# EAGLE design HoneyPI_Platine TimerBoard 2.00a (EAGLE 9.6.2)
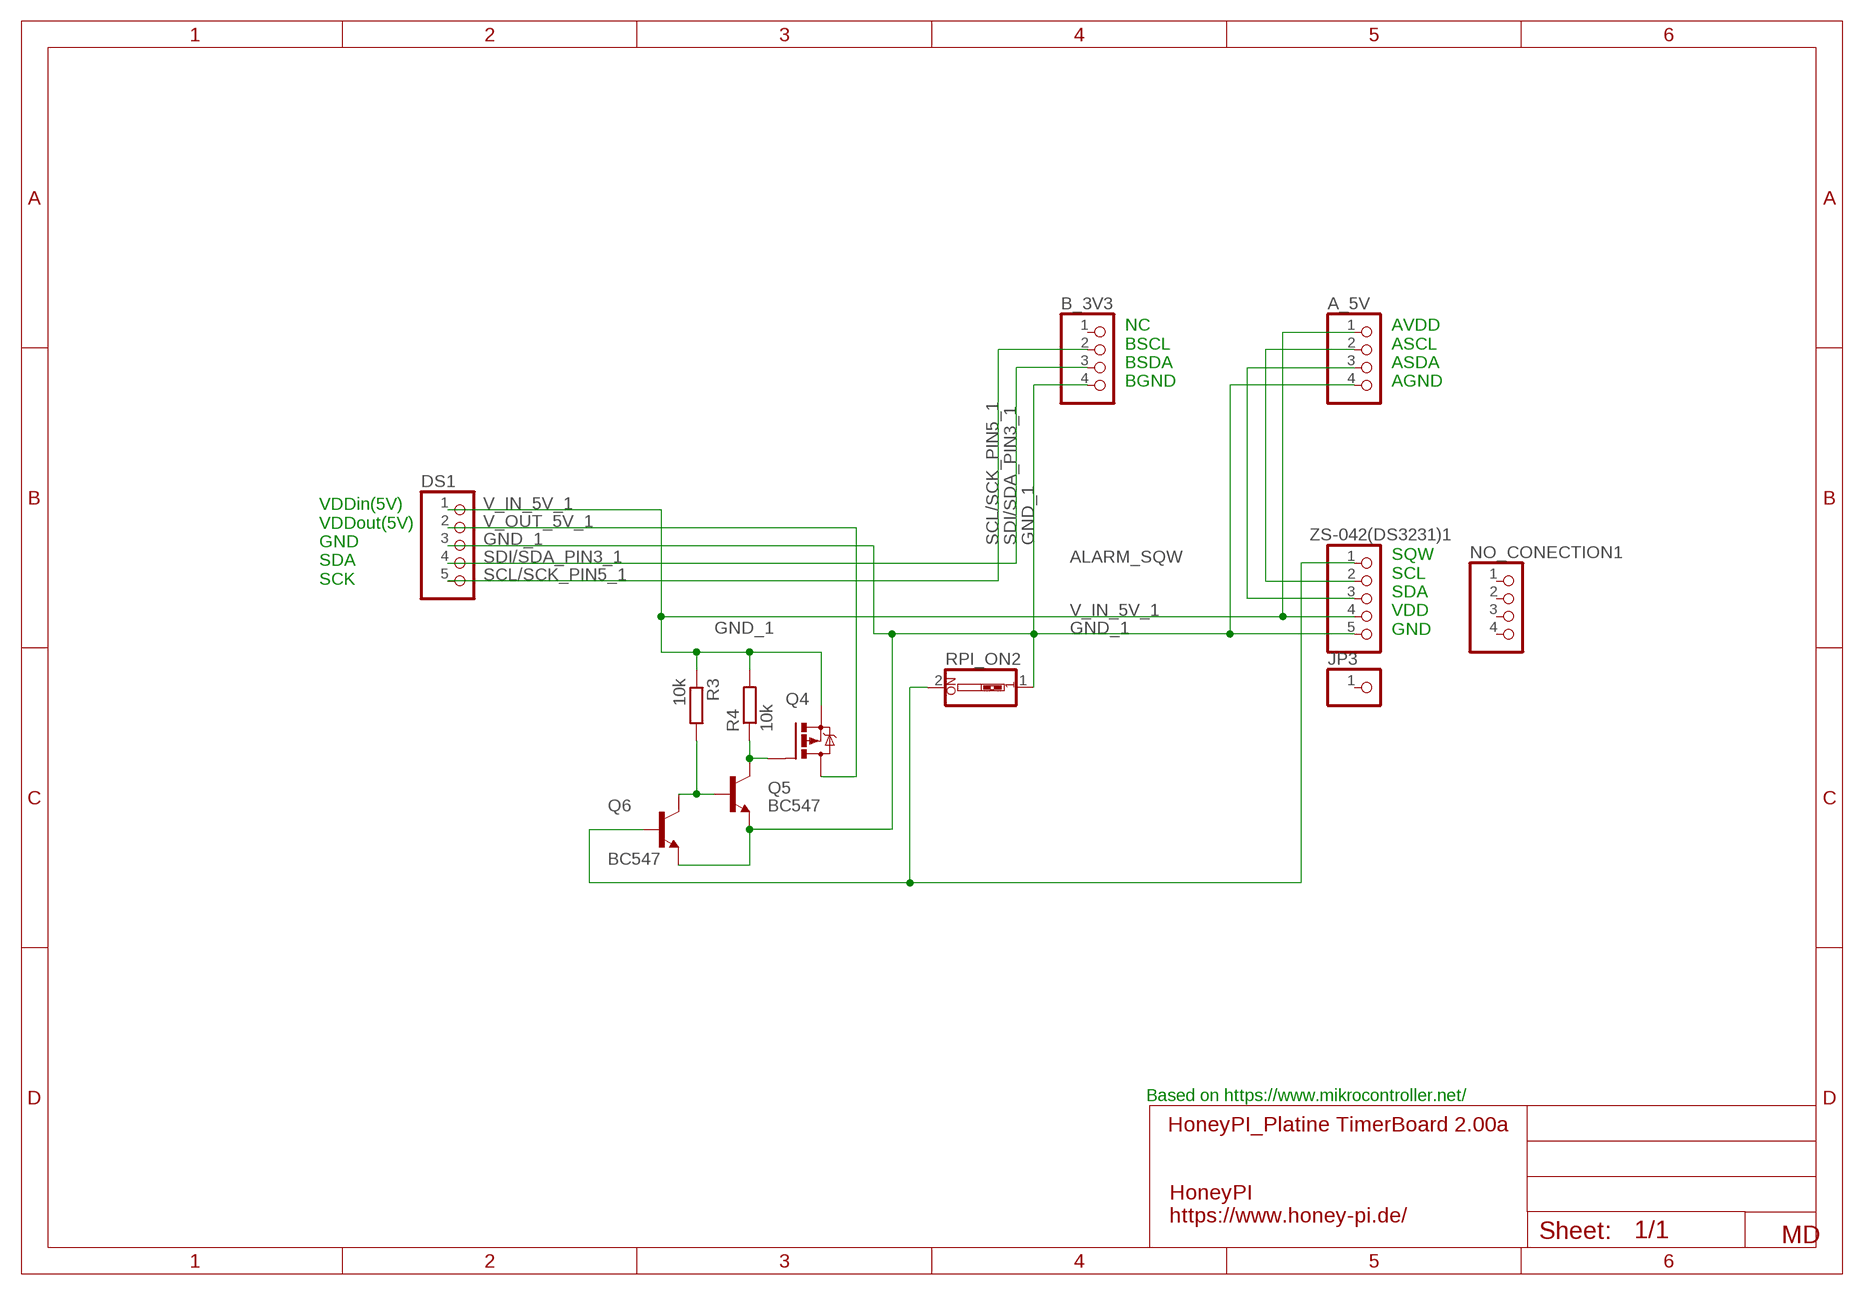
[diagram p0: schematic, sheet 1]

## Parts
A_5V  PINHD-1X4  [1X04]
B_3V3  PINHD-1X4  [1X04]
DS1  PINHD-1X5  [1X05]
JP3  PINHD-1X1  [1X01]
NO_CONECTION1  PINHD-1X4  [1X04]
Q4  NDP6020P  IRF9530  [TO220BV]
Q5  BC547  BC338  [TO92-EBC]
Q6  BC547  BC338  [TO92-EBC]
R3  10k  R-EU_0204/7  [0204/7]
R4  10k  R-EU_0204/7  [0204/7]
RPI_ON2  SW_DIP-1  [EDG-01]
ZS-042(DS3231)1  PINHD-1X5  [1X05]

## Nets
ALARM_SQW: Q6.B RPI_ON2.2 ZS-042(DS3231)1.1
GND_1 [Supply5v]: A_5V.4 B_3V3.4 DS1.3 Q5.E Q6.E RPI_ON2.1 ZS-042(DS3231)1.5
N$1: Q4.G Q5.C R4.1
N$3: Q5.B Q6.C R3.2
N$7: A_5V.3 ZS-042(DS3231)1.3
N$8: A_5V.2 ZS-042(DS3231)1.2
SCL/SCK_PIN5_1: B_3V3.2 DS1.5
SDI/SDA_PIN3_1: B_3V3.3 DS1.4
V_IN_5V_1 [Supply5v]: A_5V.1 DS1.1 Q4.S R3.1 R4.2 ZS-042(DS3231)1.4
V_OUT_5V_1 [Supply5v]: DS1.2 Q4.D
Unconnected: B_3V3.1 JP3.1 NO_CONECTION1.1 NO_CONECTION1.2 NO_CONECTION1.3 NO_CONECTION1.4

## Notes on the sheet
- NC
  BSCL
  BSDA
  BGND
- AVDD
  ASCL
  ASDA
  AGND
- VDDin(5V)
  VDDout(5V)
  GND
  SDA
  SCK
- SQW
  SCL
  SDA
  VDD
  GND
- Based on https://www.mikrocontroller.net/
- HoneyPI
  https://www.honey-pi.de/
- MD

## Library data of the parts
A_5V B_3V3 NO_CONECTION1 = pinhead:PINHD-1X4: PIN HEADER
DS1 ZS-042(DS3231)1 = pinhead:PINHD-1X5: PIN HEADER
JP3 = pinhead:PINHD-1X1: PIN HEADER
Q4 = transistor-power:IRF9530: P-CHANNEL HEXFET POWER-MOS-FET Source: http://www.irf.com/product-info/datasheets/data/irf9530.pdf
Q5 Q6 = transistor-npn:BC338*: NPN Transistor
R3 R4 = rcl:R-EU_: RESISTOR, European symbol; SPICEPREFIX: R
RPI_ON2 = special:SW_DIP-1: DIP SWITCH

## Net classes
0 Signal: width 0.152 mm, clearance 0.305 mm
1 Supply3v3: width 0.203 mm, clearance 0.305 mm
2 Supply5v: width 0.5 mm, clearance 0.305 mm

## Board
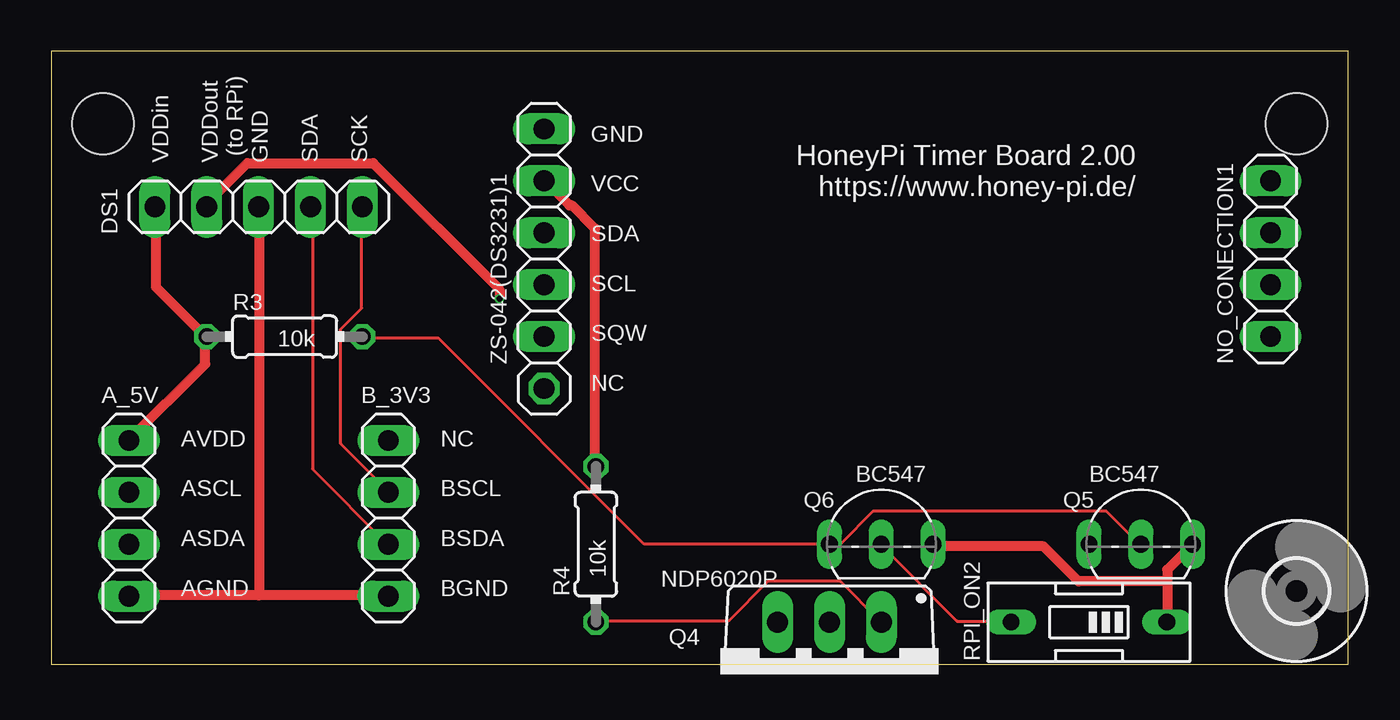
[diagram p1: board, top side]
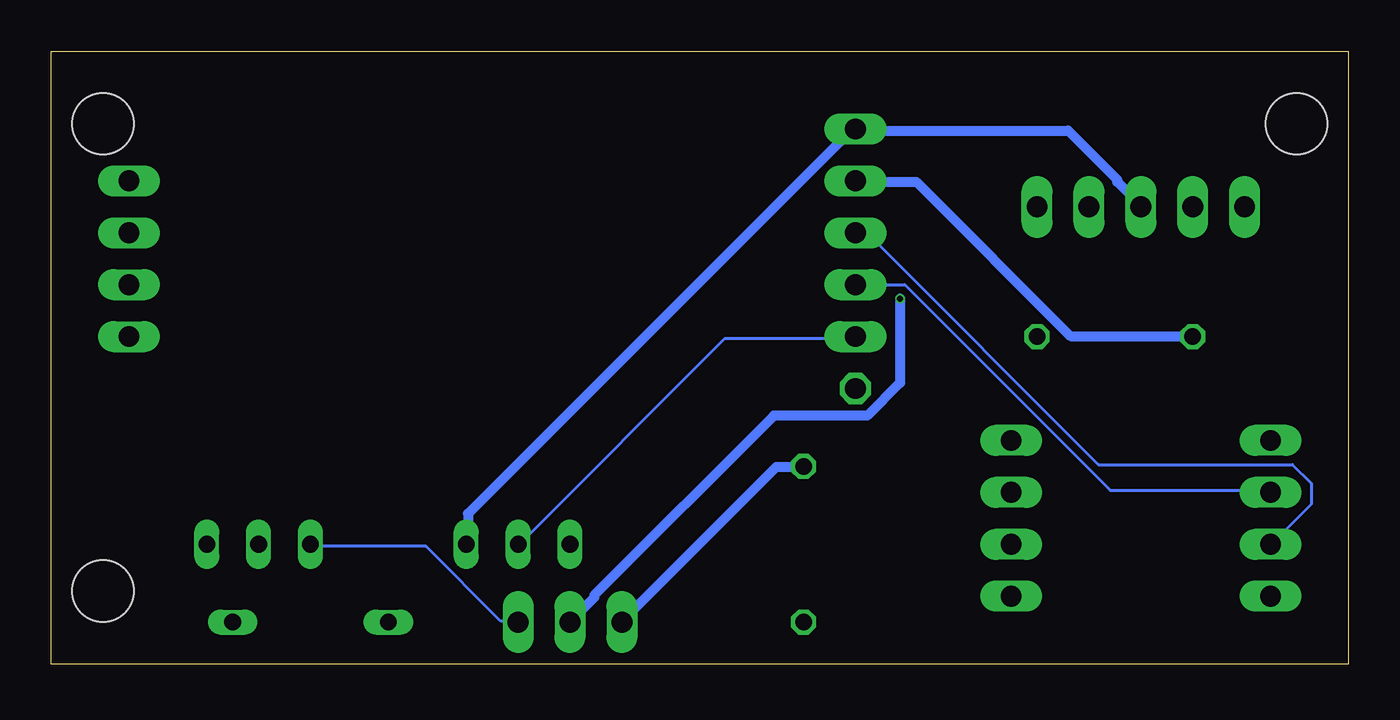
[diagram p2: board, bottom side, seen from below]

Size 63.5 x 30 mm. Coordinates in mm from the lower left corner, seen from the top.
Outline: 0,0 63.5,0 63.5,30 0,30 0,0
Copper layers (1*16): Top 0.035559375mm / dielectric 1.6mm / Bottom 0.035559375mm
Design rules "jlcpcb2layer": minimum track width 5mil, minimum drill 12mil, track to track 5mil, track to pad 5mil, pad to pad 5mil, via to via 5mil, smd to smd 5mil, copper to edge 8mil, drill to drill 6mil, minimum pad ring 5mil, minimum via ring 3mil, stop-mask expansion 2.5mil, vias tented up to drill 0mil, thermal gap 10mil
Holes 3 mm at 2.54,26.44 60.96,26.44

### Footprints (pad centres in the part's own frame; a part is rotated, then mirrored left to right if it is on the bottom)
1X04 = drill 1.016 long: 1 -3.81,0; 2 -1.27,0; 3 1.27,0; 4 3.81,0
1X05 = drill 1.016 long: 1 -5.08,0; 2 -2.54,0; 3 0,0; 4 2.54,0; 5 5.08,0
1X01 = drill 1.016 octagon: 1 0,0
TO220BV = drill 1.016 long: D 0,-2.54; G -2.54,-2.54; S 2.54,-2.54
TO92-EBC = drill 0.813 long: B 0,-1.27; C -2.54,-1.27; E 2.54,-1.27
0204/7 = drill 0.813 octagon: 1 -3.81,0; 2 3.81,0
EDG-01 = drill 0.813 long: 1 0,-3.81; 2 0,3.81
3,0 = hole 3: 0,0

### Placement (x,y rotation side)
A_5V  3.81,7.14 270 top
B_3V3  16.51,7.14 270 top
DS1  10.16,22.38 0 top
JP3  24.13,13.49 0 top
NO_CONECTION1  59.69,19.84 90 top
Q4  38.1,-0.48 180 top
Q5  53.34,7.14 0 top
Q6  40.64,7.14 0 top
R3  11.43,16.03 0 top
R4  26.67,5.87 90 top
RPI_ON2  50.8,2.06 90 top
U$1  [3,0]  60.96,3.58 0 top
ZS-042(DS3231)1  24.13,21.11 90 top

### Tracks (layer width: path | path; a pad name or v marks a point on that pad's centre or on a via)
ALARM_SQW
  Top 0.152: RPI_ON2.2 46.98,2.11 44.35,2.11 40.69,5.77 Q6.B
  Bottom 0.152: ZS-042(DS3231)1.1 24.23,15.94 30.52,15.94 40.58,5.88 Q6.B
GND_1
  Top 0.5: 54.63,4.05 54.63,4.62 Q5.E | 54.63,4.05 54.63,2.11 RPI_ON2.1 | 54.63,4.05 50.29,4.05 48.58,5.77 43.2,5.77 Q6.E | 10.17,3.37 16.46,3.37 B_3V3.4 | 10.17,3.37 3.89,3.37 A_5V.4 | 10.17,3.37 10.17,22.34 DS1.3
  Bottom 0.5: DS1.3 10.17,22.46 11.32,23.6 11.32,23.71 13.72,26.11 24.12,26.11 ZS-042(DS3231)1.5 24.35,26.11 43.09,7.37 43.09,5.88 Q6.E
N$1
  Top 0.152: R4.1 26.75,2.11 33.15,2.11 35.09,4.05 38.63,4.05 40.58,2.11 Q4.G
  Bottom 0.152: Q5.C 50.75,5.77 45.15,5.77 41.49,2.11 40.69,2.11 Q4.G
N$3
  Top 0.152: Q5.B 53.26,5.88 51.66,7.48 40.23,7.48 38.63,5.88 38.18,5.88 Q6.C 38.06,5.88 29.03,5.88 18.97,15.94 15.32,15.94 R3.2
N$7
  Bottom 0.152: A_5V.3 3.77,5.88 1.83,7.83 1.83,8.86 2.74,9.77 12.23,9.77 23.55,21.09 24.12,21.09 ZS-042(DS3231)1.3
N$8
  Bottom 0.152: ZS-042(DS3231)1.2 21.72,18.57 11.66,8.51 3.89,8.51 A_5V.2
SCL/SCK_PIN5_1
  Top 0.152: DS1.5 15.2,22.34 15.2,17.43 14.17,16.4 14.17,10.8 16.46,8.51 B_3V3.2
SDI/SDA_PIN3_1
  Top 0.152: B_3V3.3 16.46,5.88 12.8,9.54 12.8,22.34 DS1.4
V_IN_5V_1
  Top 0.5: A_5V.1 7.54,14.68 7.54,15.94 R3.1 7.43,16.17 5.14,18.46 5.14,22.34 DS1.1 | ZS-042(DS3231)1.4 24.23,23.6 25.38,22.46 25.49,22.46 26.63,21.31 26.63,9.77 R4.2
  Bottom 0.5: R4.2 26.75,9.66 28,9.66 35.55,2.11 Q4.S | R3.1 7.66,16.05 13.6,16.05 21.14,23.6 24.12,23.6 ZS-042(DS3231)1.4
V_OUT_5V_1  (via drill 0.3)
  Top 0.5: v21.95,17.88 21.95,18.34 15.77,24.51 9.6,24.51 7.54,22.46 DS1.2
  Bottom 0.5: v21.95,17.88 21.95,13.77 23.55,12.17 28.12,12.17 36.92,3.37 36.92,3.25 38.06,2.11 Q4.D

### Text on the board
tNames: VDDin / / VDDout / (to RPi) / GND / / SDA / / SCK | HoneyPi Timer Board 2.00 / https://www.honey-pi.de/ | GND / / VCC / / SDA / / SCL / / SQW / / NC | AVDD / / ASCL / / ASDA / / AGND | NC / / BSCL / / BSDA / / BGND